# EAGLE design RAMPSDC (EAGLE 8.2.2)
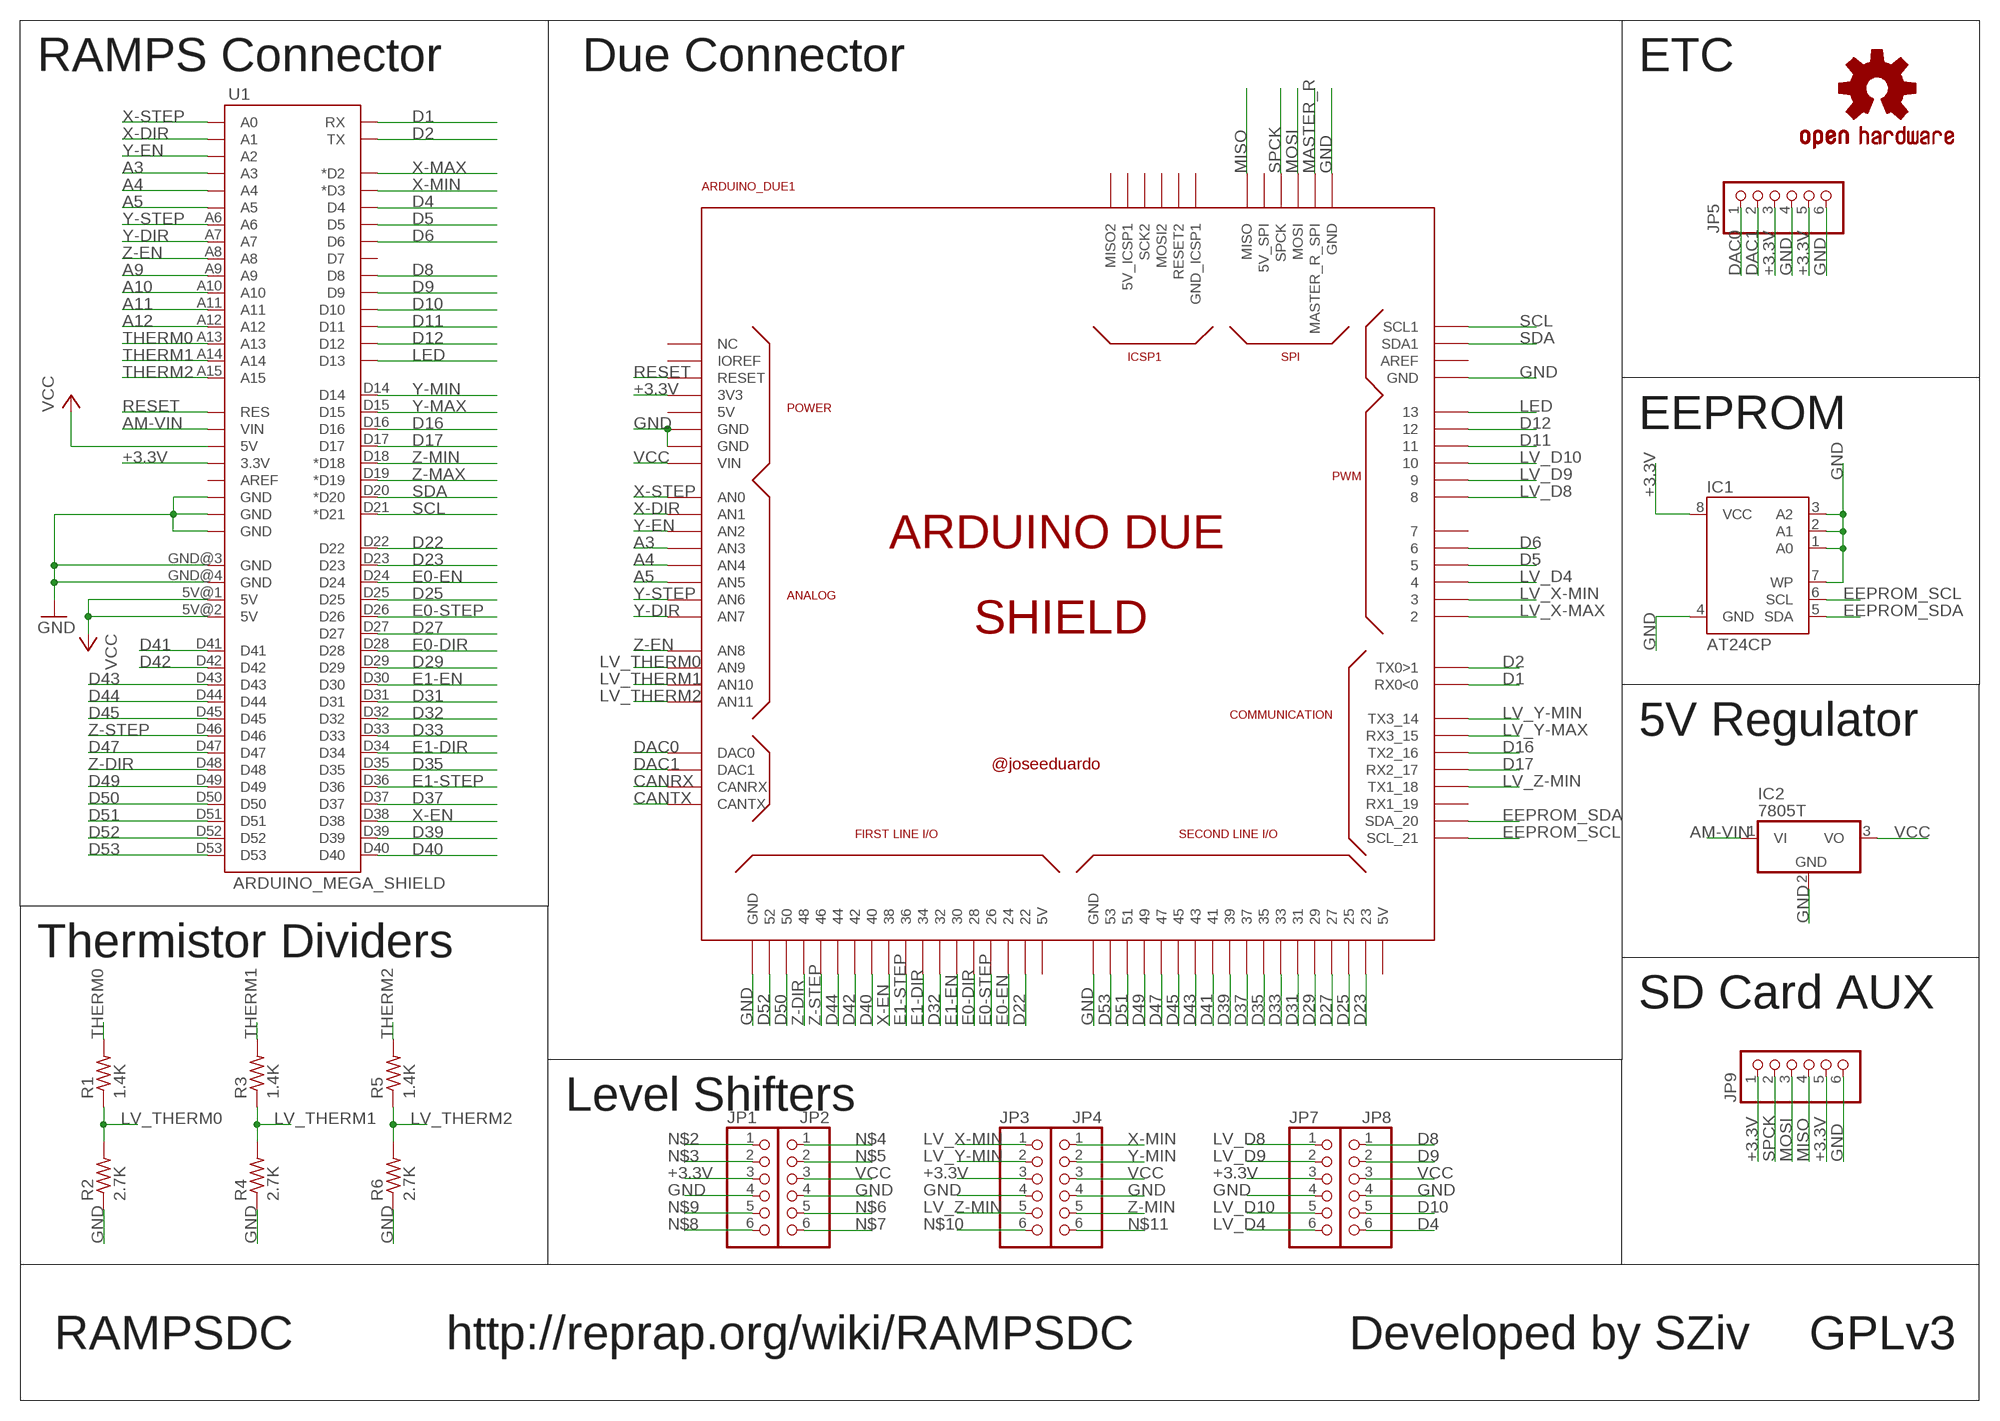
[diagram p0: schematic, sheet 1]

## Parts
ARDUINO_DUE1  ARDUINO_DUE_SHIELD  [ARDUINO_DUE_SHIELD]
IC1  AT24CP  [DIL08]
IC2  7805T  [TO220H]
JP1  PINHD-1X6  [1X06]
JP2  PINHD-1X6  [1X06]
JP3  PINHD-1X6  [1X06]
JP4  PINHD-1X6  [1X06]
JP5  PINHD-1X6  [1X06]
JP7  PINHD-1X6  [1X06]
JP8  PINHD-1X6  [1X06]
JP9  PINHD-1X6  [1X06]
LOGO1  OSHW-LOGOS  [OSHW-LOGO-S]
LOGO2  OSHW-LOGOL-COPPER  [OSHW-LOGO-L_COPPER]
R1  1.4K  R-US_R0805  [R0805]
R2  2.7K  R-US_R0805  [R0805]
R3  1.4K  R-US_R0805  [R0805]
R4  2.7K  R-US_R0805  [R0805]
R5  1.4K  R-US_R0805  [R0805]
R6  2.7K  R-US_R0805  [R0805]
U1  ARDUINO_MEGA_SHIELD  [ARDUINO_MEGA_SHIELD]

## Nets
+3.3V: ARDUINO_DUE1.3V3 IC1.8(VCC) JP1.3 JP3.3 JP5.3 JP5.5 JP7.3 JP9.1 JP9.5 U1.3.3V
A3: ARDUINO_DUE1.A3(AN3) U1.A3
A4: ARDUINO_DUE1.A4(AN4) U1.A4
A5: ARDUINO_DUE1.A5(AN5) U1.A5
A9: U1.A9
A10: U1.A10
A11: U1.A11
A12: U1.A12
AM-VIN: IC2.1(VI) U1.VIN
CANRX: ARDUINO_DUE1.CANRX
CANTX: ARDUINO_DUE1.CANTX
D1: ARDUINO_DUE1.0(RX0<0) U1.RX
D2: ARDUINO_DUE1.1(TX0>1) U1.TX
D4: JP8.6 U1.D4
D5: ARDUINO_DUE1.5 U1.D5
D6: ARDUINO_DUE1.6 U1.D6
D8: JP8.1 U1.D8
D9: JP8.2 U1.D9
D10: JP8.5 U1.D10
D11: ARDUINO_DUE1.11 U1.D11
D12: ARDUINO_DUE1.12 U1.D12
D16: ARDUINO_DUE1.16(TX2_16) U1.D16
D17: ARDUINO_DUE1.17(RX2_17) U1.D17
D22: ARDUINO_DUE1.22 U1.D22
D23: ARDUINO_DUE1.23 U1.D23
D25: ARDUINO_DUE1.25 U1.D25
D27: ARDUINO_DUE1.27 U1.D27
D29: ARDUINO_DUE1.29 U1.D29
D31: ARDUINO_DUE1.31 U1.D31
D32: ARDUINO_DUE1.32 U1.D32
D33: ARDUINO_DUE1.33 U1.D33
D35: ARDUINO_DUE1.35 U1.D35
D37: ARDUINO_DUE1.37 U1.D37
D39: ARDUINO_DUE1.39 U1.D39
D40: ARDUINO_DUE1.40 U1.D40
D41: ARDUINO_DUE1.41 U1.D41
D42: ARDUINO_DUE1.42 U1.D42
D43: ARDUINO_DUE1.43 U1.D43
D44: ARDUINO_DUE1.44 U1.D44
D45: ARDUINO_DUE1.45 U1.D45
D47: ARDUINO_DUE1.47 U1.D47
D49: ARDUINO_DUE1.49 U1.D49
D50: ARDUINO_DUE1.50 U1.D50
D51: ARDUINO_DUE1.51 U1.D51
D52: ARDUINO_DUE1.52 U1.D52
D53: ARDUINO_DUE1.53 U1.D53
DAC0: ARDUINO_DUE1.DAC0 JP5.1
DAC1: ARDUINO_DUE1.DAC1 JP5.2
E0-DIR: ARDUINO_DUE1.28 U1.D28
E0-EN: ARDUINO_DUE1.24 U1.D24
E0-STEP: ARDUINO_DUE1.26 U1.D26
E1-DIR: ARDUINO_DUE1.34 U1.D34
E1-EN: ARDUINO_DUE1.30 U1.D30
E1-STEP: ARDUINO_DUE1.36 U1.D36
EEPROM_SCL: ARDUINO_DUE1.21(SCL_21) IC1.6(SCL)
EEPROM_SDA: ARDUINO_DUE1.20(SDA_20) IC1.5(SDA)
GND: ARDUINO_DUE1.GND ARDUINO_DUE1.GND_1(GND) ARDUINO_DUE1.GND_2(GND) ARDUINO_DUE1.GND_3(GND) ARDUINO_DUE1.GND_4(GND) ARDUINO_DUE1.GND_5(GND) IC1.1(A0) IC1.2(A1) IC1.3(A2) IC1.4(GND) IC1.7(WP) IC2.2(GND) JP1.4 JP2.4 JP3.4 JP4.4 JP5.4 JP5.6 JP7.4 JP8.4 JP9.6 R2.1 R4.1 R6.1 U1.GND@0(GND) U1.GND@1(GND) U1.GND@2(GND) U1.GND@3(GND) U1.GND@4(GND)
LED: ARDUINO_DUE1.13 U1.D13
LV_D4: ARDUINO_DUE1.4 JP7.6
LV_D8: ARDUINO_DUE1.8 JP7.1
LV_D9: ARDUINO_DUE1.9 JP7.2
LV_D10: ARDUINO_DUE1.10 JP7.5
LV_THERM0: ARDUINO_DUE1.A9(AN9) R1.1 R2.2
LV_THERM1: ARDUINO_DUE1.A10(AN10) R3.1 R4.2
LV_THERM2: ARDUINO_DUE1.A11(AN11) R5.1 R6.2
LV_X-MAX: ARDUINO_DUE1.2
LV_X-MIN: ARDUINO_DUE1.3 JP3.1
LV_Y-MAX: ARDUINO_DUE1.15(RX3_15)
LV_Y-MIN: ARDUINO_DUE1.14(TX3_14) JP3.2
LV_Z-MIN: ARDUINO_DUE1.18(TX1_18) JP3.5
MASTER_R: ARDUINO_DUE1.MASTER_RESET_SPI(MASTER_R_SPI)
MISO: ARDUINO_DUE1.MISO JP9.4
MOSI: ARDUINO_DUE1.MOSI JP9.3
N$2: JP1.1
N$3: JP1.2
N$4: JP2.1
N$5: JP2.2
N$6: JP2.5
N$7: JP2.6
N$8: JP1.6
N$9: JP1.5
N$10: JP3.6
N$11: JP4.6
RESET: ARDUINO_DUE1.RESET U1.RES
SCL: ARDUINO_DUE1.SCL1 U1.D21(*D21)
SDA: ARDUINO_DUE1.SDA1 U1.D20(*D20)
SPCK: ARDUINO_DUE1.SPCK JP9.2
THERM0: R1.2 U1.A13
THERM1: R3.2 U1.A14
THERM2: R5.2 U1.A15
VCC: ARDUINO_DUE1.VIN IC2.3(VO) JP2.3 JP4.3 JP8.3 U1.5V@0(5V) U1.5V@1(5V) U1.5V@2(5V)
X-DIR: ARDUINO_DUE1.A1(AN1) U1.A1
X-EN: ARDUINO_DUE1.38 U1.D38
X-MAX: U1.D2(*D2)
X-MIN: JP4.1 U1.D3(*D3)
X-STEP: ARDUINO_DUE1.A0(AN0) U1.A0
Y-DIR: ARDUINO_DUE1.A7(AN7) U1.A7
Y-EN: ARDUINO_DUE1.A2(AN2) U1.A2
Y-MAX: U1.D15
Y-MIN: JP4.2 U1.D14
Y-STEP: ARDUINO_DUE1.A6(AN6) U1.A6
Z-DIR: ARDUINO_DUE1.48 U1.D48
Z-EN: ARDUINO_DUE1.A8(AN8) U1.A8
Z-MAX: U1.D19(*D19)
Z-MIN: JP4.5 U1.D18(*D18)
Z-STEP: ARDUINO_DUE1.46 U1.D46
Unconnected: ARDUINO_DUE1.5V0(5V) ARDUINO_DUE1.5V0_1(5V) ARDUINO_DUE1.5V0_2(5V) ARDUINO_DUE1.5V_2(5V_SPI) ARDUINO_DUE1.5V_ICSP1 ARDUINO_DUE1.7 ARDUINO_DUE1.19(RX1_19) ARDUINO_DUE1.AREF ARDUINO_DUE1.GND_ICSP1 ARDUINO_DUE1.IOREF ARDUINO_DUE1.MISO2 ARDUINO_DUE1.MOSI2 ARDUINO_DUE1.NC_2(NC) ARDUINO_DUE1.RESET2 ARDUINO_DUE1.SCK2 U1.AREF U1.D7

## Notes on the sheet
- RAMPS Connector | Due Connector | ETC
- EEPROM
- 5V Regulator
- Thermistor Dividers
- SD Card AUX
- Level Shifters
- RAMPSDC | http://reprap.org/wiki/RAMPSDC | Developed by SZiv | GPLv3

## Library data of the parts
ARDUINO_DUE1 = arduino_due_shield:ARDUINO_DUE_SHIELD
IC1 = atmel:AT24C*: 2-wire serial EEPROM; MPN: AT24C1024BW-SH-B; OC_FARNELL: 1362646; OC_NEWARK: 03P2044
IC2 = adafruit:78*: Positive VOLTAGE REGULATOR Added bigger pads to the TO-92 package
JP1-JP5 JP7-JP9 = adafruit:PINHD-1X6: PIN HEADER
LOGO1 LOGO2 = SparkFun-Aesthetics:OSHW-LOGO: Open-Source Hardware (OSHW) Logo This logo indicates the piece of hardware it is found on incorporates a OSHW license and/or adheres to the definition of open source hardware found here: http://freedomdefined.org/OSHW
R1-R6 = adafruit:R-US_: RESISTOR, American symbol
U1 = RAMPS:ARDUINO_MEGA_SHIELD

## Board
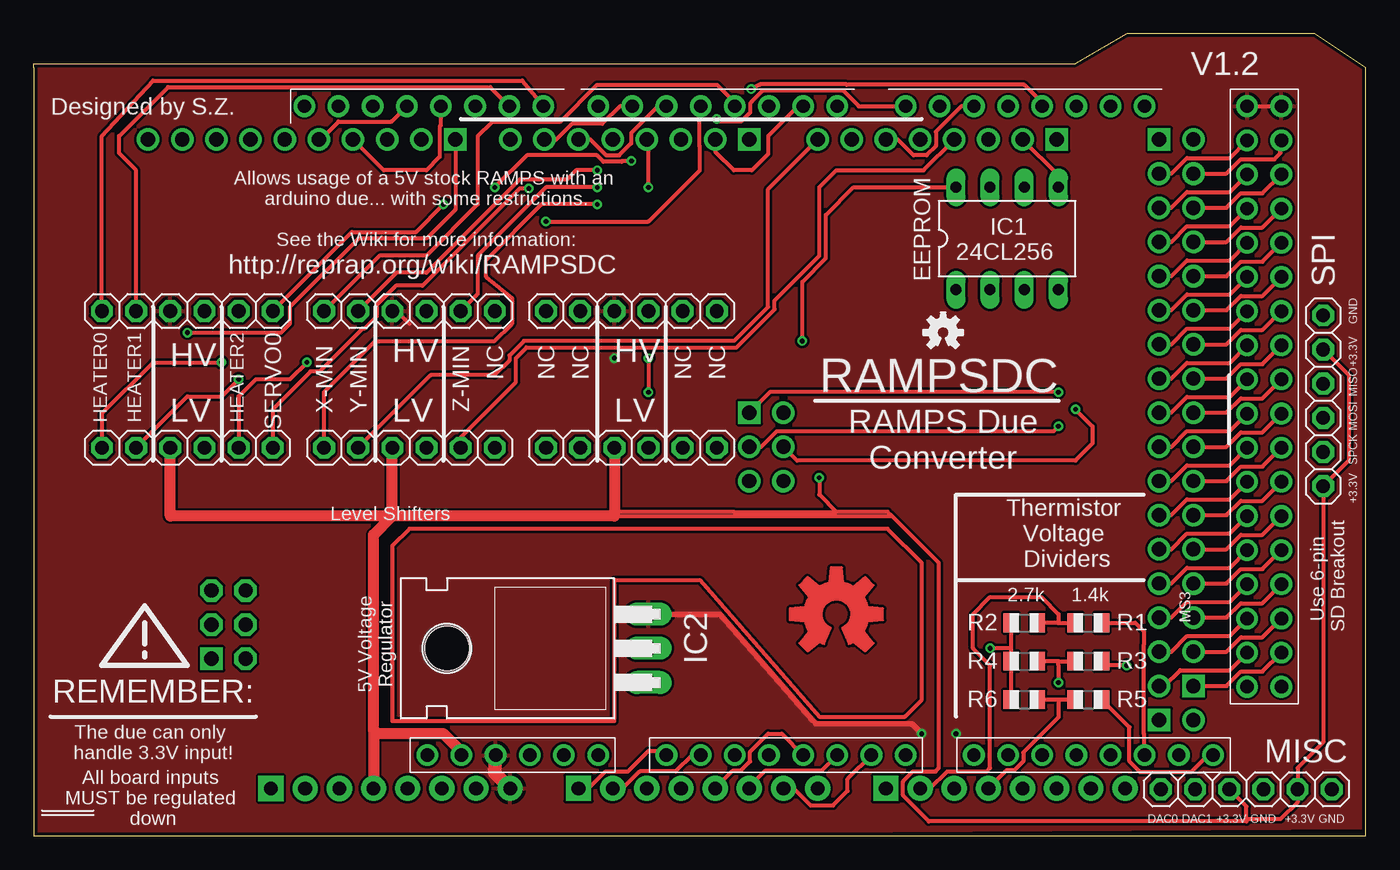
[diagram p1: board, top side]
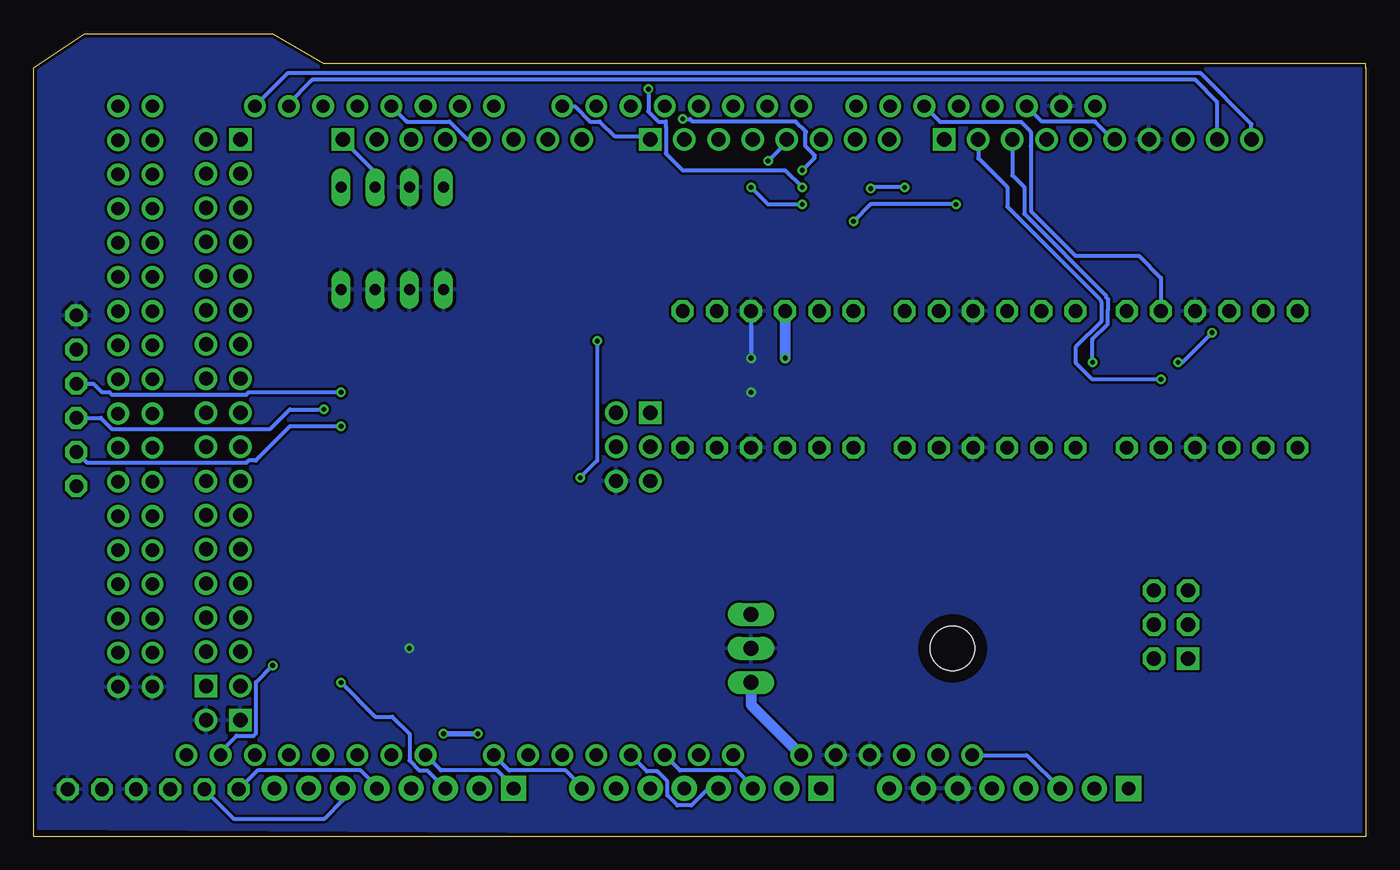
[diagram p2: board, bottom side, seen from below]

Size 99.06 x 59.69 mm. Coordinates in mm from the lower left corner, seen from the top.
Outline: 99.05,57.14 99.05,0 0,0 0,57.14
Outline: 99.06,57.15 95.25,59.69 81.28,59.69 77.47,57.47 0,57.47 0,57.15
Copper layers (1*16): Top 0.035mm / dielectric 1.5mm / Bottom 0.035mm
Design rules "GoldPhoenix": minimum track width 7mil, minimum drill 15mil, track to track 7mil, track to pad 7mil, pad to pad 7mil, via to via 7mil, smd to smd 7mil, copper to edge 10mil, drill to drill 8mil, minimum pad ring 12mil, minimum via ring 7mil, stop-mask expansion 4mil, vias tented up to drill 25mil, thermal gap 10mil

### Footprints (pad centres in the part's own frame; a part is rotated, then mirrored left to right if it is on the bottom)
ARDUINO_DUE_SHIELD = drill 1.067 square: 0 63.373,51.816; 5V0_1 93.853,51.816; 8 41.529,51.816; 21 86.233,51.816; 53 96.393,11.176; GND_2 93.853,8.636; MISO 63.373,31.496; MISO2 23.384,13.196 | drill 1.067: 1 60.833,51.816; 2 58.293,51.816; 3 55.753,51.816; 4 53.213,51.816; 5 50.673,51.816; 5V0_2 96.393,51.816; 5V_2 65.913,31.496; 6 48.133,51.816; 7 45.593,51.816; 9 38.989,51.816; 10 36.449,51.816; 11 33.909,51.816; 12 31.369,51.816; 13 28.829,51.816; 14 68.453,51.816; 15 70.993,51.816; 16 73.533,51.816; 17 76.073,51.816; 18 78.613,51.816; 19 81.153,51.816; 20 83.693,51.816; 22 93.853,49.276; 23 96.393,49.276; 24 93.853,46.736; 25 96.393,46.736; 26 93.853,44.196; 27 96.393,44.196; 28 93.853,41.656; 29 96.393,41.656; 30 93.853,39.116; 31 96.393,39.116; 32 93.853,36.576; 33 96.393,36.576; 34 93.853,34.036; 35 96.393,34.036; 36 93.853,31.496; 37 96.393,31.496; 38 93.853,28.956; 39 96.393,28.956; 40 93.853,26.416; 41 96.393,26.416; 42 93.853,23.876; 43 96.393,23.876; 44 93.853,21.336; 45 96.393,21.336; 46 93.853,18.796; 47 96.393,18.796; 48 93.853,16.256; 49 96.393,16.256; 50 93.853,13.716; 51 96.393,13.716; 52 93.853,11.176; AREF 23.749,51.816; GND_3 96.393,8.636; GND_4 26.289,51.816; GND_5 65.913,26.416; MASTER_RESET_SPI 63.373,26.416; MOSI 65.913,28.956; SCL1 18.669,51.816; SDA1 21.209,51.816; SPCK 63.373,28.956 | drill 1.016 pad 1.88: 3V3 35.433,3.556; 5V0 37.973,3.556; A1 53.213,3.556; A2 55.753,3.556; A3 58.293,3.556; A4 60.833,3.556; A5 63.373,3.556; A6 65.913,3.556; A7 68.453,3.556; A9 76.073,3.556; A10 78.613,3.556; A11 81.153,3.556; CANRX 88.773,3.556; CANTX 91.313,3.556; DAC0 83.693,3.556; DAC1 86.233,3.556; GND 40.513,3.556; GND_1 43.053,3.556; IOREF 30.346,3.543; RESET 32.893,3.555; VIN 45.593,3.556 | drill 1.067 octagon: 5V_ICSP1 25.924,13.196; GND_ICSP1 25.924,18.276; MOSI2 25.924,15.736; RESET2 23.384,18.276; SCK2 23.384,15.736 | drill 1.016 pad 1.88 square: A0 50.673,3.556; A8 73.533,3.556; NC_2 27.806,3.543
DIL08 = drill 0.813 long: 1 -3.81,-3.81; 2 -1.27,-3.81; 3 1.27,-3.81; 4 3.81,-3.81; 5 3.81,3.81; 6 1.27,3.81; 7 -1.27,3.81; 8 -3.81,3.81
TO220H = drill 1.118 long: 1 -2.54,-10.16; 2 0,-10.16; 3 2.54,-10.16 | hole 3.302: 0,4.826
1X06 = drill 1.016 octagon: 1 -6.35,0; 2 -3.81,0; 3 -1.27,0; 4 1.27,0; 5 3.81,0; 6 6.35,0
R0805 = smd 1.1 x 1.4: 1 -1,0; 2 1,0
ARDUINO_MEGA_SHIELD = drill 1 pad 1.422: 3.3V 50.8,26.67; 5V@0 50.8,29.21; 5V@1 2.54,85.09; 5V@2 2.54,87.63; A0 50.8,41.91; A1 50.8,44.45; A2 50.8,46.99; A3 50.8,49.53; A4 50.8,52.07; A5 50.8,54.61; A6 50.8,57.15; A7 50.8,59.69; A8 50.8,64.77; A9 50.8,67.31; A10 50.8,69.85; A11 50.8,72.39; A12 50.8,74.93; A13 50.8,77.47; A14 50.8,80.01; A15 50.8,82.55; AREF 2.54,14.986; D2 2.54,49.53; D3 2.54,46.99; D4 2.54,44.45; D5 2.54,41.91; D6 2.54,39.37; D7 2.54,36.83; D8 2.54,32.766; D9 2.54,30.226; D10 2.54,27.686; D11 2.54,25.146; D12 2.54,22.606; D13 2.54,20.066; D14 2.54,59.69; D15 2.54,62.23; D16 2.54,64.77; D17 2.54,67.31; D18 2.54,69.85; D19 2.54,72.39; D20 2.54,74.93; D21 2.54,77.47; D22 5.08,85.09; D23 5.08,87.63; D24 7.62,85.09; D25 7.62,87.63; D26 10.16,85.09; D27 10.16,87.63; D28 12.7,85.09; D29 12.7,87.63; D30 15.24,85.09; D31 15.24,87.63; D32 17.78,85.09; D33 17.78,87.63; D34 20.32,85.09; D35 20.32,87.63; D36 22.86,85.09; D37 22.86,87.63; D38 25.4,85.09; D39 25.4,87.63; D40 27.94,85.09; D41 27.94,87.63; D42 30.48,85.09; D43 30.48,87.63; D44 33.02,85.09; D45 33.02,87.63; D46 35.56,85.09; D47 35.56,87.63; D48 38.1,85.09; D49 38.1,87.63; D50 40.64,85.09; D51 40.64,87.63; D52 43.18,85.09; D53 43.18,87.63; GND@0 50.8,31.75; GND@1 50.8,34.29; GND@2 2.54,17.526; GND@3 45.72,85.09; GND@4 45.72,87.63; RES 50.8,24.13; RX 2.54,54.61; TX 2.54,52.07; VIN 50.8,36.83

### Placement (x,y rotation side)
ARDUINO_DUE1  -10.16,0 0 top
IC1  72.39,44.45 0 top
IC2  35.56,13.97 90 top
JP1  44.45,28.89 0 top
JP2  44.45,39.05 0 top
JP3  27.94,28.89 0 top
JP4  27.94,39.05 0 top
JP5  90.17,3.49 0 top
JP7  11.43,28.89 0 top
JP8  11.43,39.05 0 top
JP9  95.89,32.38 90 top
LOGO1  67.63,37.47 0 top
LOGO2  59.69,16.51 0 top
R1  78.42,15.88 0 top
R2  73.66,15.88 0 top
R3  78.42,13.02 0 top
R4  73.66,13.02 0 top
R5  78.42,10.16 0 top
R6  73.66,10.16 0 top
U1  5.14,56.83 270 top

### Tracks (layer width: path | path; a pad name or v marks a point on that pad's centre or on a via)
+3.3V  (via drill 0.35)
  Top 0.305: 90.17,1.1 66.57,1.1 64.64,3.03 64.64,4.08 65.39,4.83 67.06,4.83 67.31,5.08 67.31,20.32 63.82,23.81 | 63.82,23.81 63.5,24.13 59.69,24.13 | 52.04,24.13 59.69,24.13 | 52.04,24.13 43.5,24.13 43.18,23.81 63.82,23.81 | 52.05,24.13 52.04,24.13 | 59.69,24.13 58.42,25.4 v58.42,26.67 | v57.15,36.83 57.15,41.23 58.9,42.98 58.9,46.2 60.96,48.26 IC1.8 | 90.17,1.1 90.17,2.22 JP5.3 | 90.17,1.1 90.33,1.27 92.71,1.27 93.98,2.54 93.98,3.23 JP5.5 93.98,5.08 95.89,6.99 JP9.1 97.79,27.94 97.79,34.29 JP9.5
  Top 0.813: 26.67,23.81 JP3.3 | 26.67,23.81 10.16,23.81 JP7.3 | JP1.3 43.18,23.81 26.67,23.81 | 25.27,7.9 ARDUINO_DUE1.3V3 | 25.27,7.9 25.27,22.42 26.67,23.81 | U1.3.3V 31.81,6.29 30.48,7.62 25.4,7.62 25.4,7.77 25.27,7.9
  Bottom 0.305: v57.15,36.83 57.15,27.94 v58.42,26.67
A3
  Bottom 0.305: U1.A3 53.47,4.83 52.69,4.83 51.94,4.08 51.94,3.03 51.2,2.29 50.15,2.29 48.88,3.56 ARDUINO_DUE1.A3
A4
  Top 0.305: ARDUINO_DUE1.A4 52.01,4.9 52.6,4.9 53.27,5.56 53.27,6.28 54.61,7.62 55.63,7.62 U1.A4
A5
  Top 0.305: ARDUINO_DUE1.A5 53.21,3.68 54.43,4.9 58.62,4.9 U1.A5
AM-VIN
  Bottom 0.813: IC2.1 45.72,9.78 U1.VIN
D1
  Bottom 0.305: U1.RX 58.82,54.29 57.68,53.16 56.97,53.16 55.88,52.07 53.47,52.07 ARDUINO_DUE1.0
D2
  Top 0.305: ARDUINO_DUE1.1 50.67,50.93 52.07,49.53 53.4,49.53 54.61,50.74 54.61,52.07 56.83,54.29 U1.TX
D4  (via drill 0.35)
  Top 0.305: U1.D4 49.51,54.2 49.51,51.33 49.53,51.31 49.53,49.53 45.72,45.72 v38.1,45.72 | v30.48,46.99 28.42,44.93 23.66,44.93 JP8.6
  Bottom 0.305: v30.48,46.99 36.83,46.99 v38.1,45.72
D5
  Top 0.305: ARDUINO_DUE1.5 41.4,51.82 42.57,50.65 43.54,50.65 44.42,51.53 44.42,52.3 46.42,54.29 U1.D5
D6
  Top 0.305: ARDUINO_DUE1.6 38.86,51.82 40.03,52.98 42.28,52.98 43.59,54.29 U1.D6
D8
  Top 0.305: JP8.1 5.08,52.07 8.89,56.2 36.32,56.2 U1.D8
D9
  Top 0.305: JP8.2 7.62,49.53 6.35,50.8 6.35,52.07 9.99,55.72 33.95,55.72 U1.D9
D10
  Bottom 0.305: U1.D10 31.65,53.11 25.63,53.11 24.92,52.4 24.92,51.33 24.89,51.31 24.89,46.48 21.59,43.18 16.89,43.18 15.24,41.52 JP8.5
D11
  Top 0.305: U1.D11 30.29,52.88 30.2,52.79 30.2,50.52 29.21,49.53 26.04,49.53 ARDUINO_DUE1.11
D12
  Top 0.305: ARDUINO_DUE1.12 21.34,51.82 22.68,53.16 26.61,53.16 U1.D12
D16
  Top 0.305: U1.D16 68.98,54.29 67.08,52.4 67.08,51.33 66.4,50.65 65.43,50.65 64.26,51.82 ARDUINO_DUE1.16
D17
  Bottom 0.305: ARDUINO_DUE1.17 66.8,51.82 68.14,53.16 71.32,53.16 U1.D17
D22
  Top 0.305: ARDUINO_DUE1.22 84.58,49.28 85.75,50.44 88.92,50.44 U1.D22
D23
  Top 0.305: ARDUINO_DUE1.23 88.69,49.28 89.76,50.35 92.26,50.35 92.71,50.8 92.71,51.69 U1.D23
D25
  Top 0.305: ARDUINO_DUE1.25 88.69,46.74 89.76,47.81 91.37,47.81 U1.D25
D27
  Top 0.305: ARDUINO_DUE1.27 88.69,44.2 89.76,45.27 91.37,45.27 U1.D27
D29
  Top 0.305: ARDUINO_DUE1.29 88.69,41.66 89.76,42.73 91.37,42.73 U1.D29
D31
  Top 0.305: ARDUINO_DUE1.31 88.69,39.12 89.76,40.19 91.37,40.19 U1.D31
D32
  Top 0.305: ARDUINO_DUE1.32 84.58,36.58 85.75,37.74 88.92,37.74 U1.D32
D33
  Top 0.305: ARDUINO_DUE1.33 88.69,36.58 89.76,37.65 91.37,37.65 U1.D33
D35
  Top 0.305: ARDUINO_DUE1.35 88.69,34.04 89.76,35.11 91.37,35.11 U1.D35
D37
  Top 0.305: ARDUINO_DUE1.37 88.69,31.5 89.76,32.57 91.37,32.57 U1.D37
D39
  Top 0.305: ARDUINO_DUE1.39 88.69,28.96 89.76,30.03 91.37,30.03 U1.D39
D40
  Top 0.305: ARDUINO_DUE1.40 84.58,26.42 85.75,27.58 88.92,27.58 U1.D40
D41
  Top 0.305: ARDUINO_DUE1.41 88.69,26.42 89.76,27.49 91.37,27.49 U1.D41
D42
  Top 0.305: ARDUINO_DUE1.42 84.58,23.88 85.75,25.04 88.92,25.04 U1.D42
D43
  Top 0.305: ARDUINO_DUE1.43 88.69,23.88 89.76,24.95 91.37,24.95 U1.D43
D44
  Top 0.305: ARDUINO_DUE1.44 84.58,21.34 85.75,22.5 88.92,22.5 U1.D44
D45
  Top 0.305: ARDUINO_DUE1.45 88.69,21.34 89.76,22.41 91.37,22.41 U1.D45
D47
  Top 0.305: ARDUINO_DUE1.47 88.69,18.8 89.76,19.87 91.37,19.87 U1.D47
D49
  Top 0.305: ARDUINO_DUE1.49 88.69,16.26 89.76,17.33 91.37,17.33 U1.D49
D50
  Top 0.305: ARDUINO_DUE1.50 84.58,13.72 85.75,14.88 88.92,14.88 U1.D50
D51
  Top 0.305: ARDUINO_DUE1.51 88.69,13.72 89.76,14.79 91.37,14.79 U1.D51
D52
  Top 0.305: ARDUINO_DUE1.52 84.09,11.18 85.26,12.34 88.92,12.34 U1.D52
D53
  Top 0.305: ARDUINO_DUE1.53 88.69,11.18 89.76,12.25 91.37,12.25 U1.D53
DAC0
  Bottom 0.305: ARDUINO_DUE1.DAC0 73.53,3.68 74.75,4.9 82.42,4.9 JP5.1
DAC1
  Bottom 0.305: ARDUINO_DUE1.DAC1 76.07,2.67 77.47,1.27 84.14,1.27 JP5.2
E0-DIR
  Top 0.305: ARDUINO_DUE1.28 84.58,41.66 85.75,42.82 88.92,42.82 U1.D28
E0-EN
  Top 0.305: ARDUINO_DUE1.24 84.58,46.74 85.75,47.9 88.92,47.9 U1.D24
E0-STEP
  Top 0.305: ARDUINO_DUE1.26 84.58,44.2 85.75,45.36 88.92,45.36 U1.D26
E1-DIR
  Top 0.305: ARDUINO_DUE1.34 84.58,34.04 85.75,35.2 88.92,35.2 U1.D34
E1-EN
  Top 0.305: ARDUINO_DUE1.30 84.58,39.12 85.75,40.28 88.92,40.28 U1.D30
E1-STEP
  Top 0.305: ARDUINO_DUE1.36 84.58,31.5 85.75,32.66 88.92,32.66 U1.D36
EEPROM_SCL
  Bottom 0.305: IC1.6 73.66,49.4 ARDUINO_DUE1.21
EEPROM_SDA
  Top 0.305: IC1.5 76.2,49.15 ARDUINO_DUE1.20
GND  (via drill 0.35)
  Top 0.305: R6.1 R4.1 72.66,13.97 | R2.1 72.66,13.97 | 72.66,13.97 v71.12,13.97 | v45.72,35.56 v45.72,33.02
  Bottom 0.305: JP2.4 v45.72,35.56
  pour Bottom: -1.27,57.15 99.38,60.33 99.38,0.64 -1.27,0
HS
  Top 0.305: 26.67,21.59 26.67,8.57 43.18,8.57 43.18,19.05 49.53,19.05 58.42,8.89 64.77,8.89 66.04,10.16 66.04,20.32 63.5,22.86 27.94,22.86 26.67,21.59
LED
  Bottom 0.305: ARDUINO_DUE1.13 18.8,51.82 20.14,53.16 24.07,53.16 U1.D13
LV_D4  (via drill 0.35)
  Top 0.305: v44.45,50.21 43.78,50.21 43.74,50.16 42.37,50.16 41.89,50.65 36.68,50.65 v34.29,48.26 | v36.83,48.16 36.15,48.16 28.92,40.93 26.93,40.93 25.53,39.53 25.53,38.67 24.63,37.77 24.46,37.77 21.25,34.56 20.59,34.56 17.78,31.75 JP7.6
  Bottom 0.305: ARDUINO_DUE1.4 43.05,51.61 v44.45,50.21 | v34.29,48.26 36.73,48.26 v36.83,48.16
LV_D8  (via drill 0.35)
  Top 0.305: JP7.1 5.08,31.43 8.89,35.24 v13.97,35.24 | v11.43,37.45 18.4,37.45 19.05,38.1 19.05,39.34 24.16,44.45 29.21,44.45 31.37,46.61 ARDUINO_DUE1.8
  Bottom 0.305: v13.97,35.24 13.64,35.24 v11.43,37.45
LV_D9  (via drill 0.35)
  Top 0.305: JP7.2 11.43,32.7 13.97,32.7 v15.24,33.97
  Bottom 0.305: v15.24,33.97 20.32,33.97 21.59,35.24 21.59,36.37 19.68,38.28 19.68,39.77 19.81,39.97 26.67,46.84 26.67,48.26 28.83,50.42 ARDUINO_DUE1.9
LV_D10  (via drill 0.35)
  Top 0.305: v20.32,35.24 19.05,33.97 16.51,33.97 15.24,32.7 JP7.5
  Bottom 0.305: ARDUINO_DUE1.10 26.29,49.15 25.4,48.26 25.4,46.29 19.4,40.3 19.32,40.17 19.32,40.11 19.3,40.07 19.2,39.97 19.17,39.92 19.17,39.16 19.2,39.12 19.2,38.08 20.32,36.96 v20.32,35.24
LV_THERM0
  Top 0.305: 76.11,15.88 R1.1 | 76.11,15.88 R2.2 | ARDUINO_DUE1.A9 66.66,3.56 67.93,4.83 70.87,4.83 71.12,5.08 71.12,12.7 69.85,13.97 69.85,16.51 71.12,17.78 74.93,17.78 76.2,16.51 76.2,15.97 76.11,15.88
LV_THERM1  (via drill 0.35)
  Top 0.305: 76.2,13.02 76.2,12.95 | v76.2,11.43 76.2,12.7 76.2,12.95 | 76.14,13.02 R3.1 | 76.14,13.02 R4.2 | 76.2,12.95 76.14,13.02
  Bottom 0.305: v76.2,11.43 73.66,8.89 72.39,8.89 71.12,7.62 71.12,5.63 70.38,4.9 69.79,4.9 ARDUINO_DUE1.A10
LV_THERM2
  Top 0.305: R5.1 76.2,10.16 | 76.2,10.16 R6.2 | ARDUINO_DUE1.A11 72.33,4.9 72.92,4.9 73.59,5.56 73.59,6.23 76.2,8.84 76.2,10.16
LV_X-MIN  (via drill 0.35)
  Top 0.305: JP3.1 21.59,33.02 25.4,36.83 34.29,36.83 35.56,38.1 35.56,40.01 33.66,41.59 33.66,42.86 37.78,46.99 v41.91,46.99 | v45.72,48.26 45.72,51.69 ARDUINO_DUE1.3
  Bottom 0.305: v41.91,46.99 44.45,46.99 v45.72,48.26
LV_Y-MIN
  Top 0.305: ARDUINO_DUE1.14 54.61,48.13 54.61,39.37 52.07,36.83 36.45,36.83 35.38,35.76 35.38,35.38 34.29,34.29 29.53,34.29 JP3.2
LV_Z-MIN
  Top 0.305: ARDUINO_DUE1.18 66.17,49.53 59.69,49.53 58.42,48.26 58.42,43.18 55.09,39.85 55.09,39.17 52.27,36.35 36.65,36.35 35.86,35.56 35.86,33.78 31.75,29.66 JP3.5
MISO  (via drill 0.35)
  Top 0.305: v76.2,33.02 54.74,33.02 ARDUINO_DUE1.MISO
  Bottom 0.305: JP9.4 94.61,33.66 93.98,33.02 93.43,33.02 93.24,32.84 83.24,32.84 83.06,33.02 v76.2,33.02
MOSI  (via drill 0.35)
  Top 0.305: v77.47,31.75 78.74,30.48 78.74,29.21 77.47,27.94 56.77,27.94 ARDUINO_DUE1.MOSI
  Bottom 0.305: JP9.3 94.06,31.11 93.24,30.3 81.46,30.3 80.01,31.75 v77.47,31.75
N$1
  pour Top: 26.67,8.89 26.67,21.59 27.94,22.86 63.5,22.86 66.04,20.32 66.04,8.89
RESET
  Bottom 0.305: U1.RES 25.21,6.03 ARDUINO_DUE1.RESET
SCL
  Bottom 0.305: ARDUINO_DUE1.SCL1 8.51,52.96 12.28,56.73 80.17,56.73 U1.D21
SDA
  Bottom 0.305: 80.17,54.42 80.33,54.61 | 80.17,54.42 U1.D20 | ARDUINO_DUE1.SDA1 11.05,54.6 12.7,56.25 78.34,56.25 80.17,54.42
SPCK  (via drill 0.35)
  Top 0.305: ARDUINO_DUE1.SPCK 54.1,28.96 55.27,30.12 75.84,30.12 v76.2,30.48
  Bottom 0.305: v76.2,30.48 80.01,30.48 82.55,27.94 83.06,27.94 83.24,27.76 95.07,27.76 JP9.2
THERM0
  Top 0.305: R1.2 81.92,15.88 82.55,15.24 82.55,14.22 82.53,14.2 82.53,7.66 82.55,7.64 82.55,6.1 U1.A13
THERM1  (via drill 0.35)
  Top 0.305: v81.28,12.7 79.74,12.7 R3.2
  Bottom 0.305: U1.A14 85.15,6.29 83.97,7.47 82.7,7.47 82.55,7.62 82.55,7.64 82.53,7.66 82.53,11.46 v81.28,12.7
THERM2
  Top 0.305: U1.A15 87.31,6.03 86.06,4.79 82.25,4.79 81.48,5.56 81.48,8.1 R5.2
VCC  (via drill 0.35)
  Top 0.305: U1.5V@1 U1.5V@2 | JP4.3 26.99,39.05 27.94,38.1
  Top 0.406: IC2.3 51.03,16.51 57.89,8.67 58.03,8.53 58.16,8.37 58.19,8.37 58.2,8.36 58.4,8.34 65.32,8.34 v66.04,7.62
  Top 1.016: U1.5V@0 34.29,4.7 ARDUINO_DUE1.VIN
  Bottom 0.406: v66.04,7.62 v68.58,7.62
  Bottom 0.813: JP2.3 v43.18,35.56
  pour Top: -1.27,57.15 99.38,60.33 99.38,0.64 -1.27,0
X-DIR
  Top 0.305: ARDUINO_DUE1.A1 43.8,3.56 45.07,4.83 47.74,4.83 48.95,6.03 U1.A1
X-EN
  Top 0.305: ARDUINO_DUE1.38 84.58,28.96 85.75,30.12 88.92,30.12 U1.D38
X-MIN
  Top 0.305: U1.D3 52.13,54.55 50.8,55.88 41.91,55.88 39.19,53.16 34.11,53.16 33.02,52.07 33.02,46.99 29.21,43.18 25.72,43.18 JP4.1
X-STEP
  Top 0.305: ARDUINO_DUE1.A0 41.26,3.56 42.53,4.83 44.2,4.83 45.72,6.35 46.74,6.35 U1.A0
Y-DIR
  Bottom 0.305: 64.77,6.35 U1.A7 63.7,4.9 59.51,4.9 58.29,3.68 ARDUINO_DUE1.A7
Y-EN
  Bottom 0.305: ARDUINO_DUE1.A2 45.59,3.68 46.81,4.9 51,4.9 U1.A2
Y-MIN  (via drill 0.35)
  Top 0.305: U1.D14 61.36,54.29 60.22,55.43 54.2,55.43 53.39,54.61 | 53.34,54.61 53.39,54.61 | 53.39,54.61 53.27,54.49 53.27,53.82 52.6,53.16 50.98,53.16 v50.8,53.34 | v41.91,49.53 40.34,49.53 39.65,48.85 36.15,48.85 29.21,41.91 26.99,41.91 JP4.2
  Bottom 0.305: v50.8,53.34 50.25,53.34 50.06,53.16 42.4,53.16 41.61,52.37 41.68,52.3 41.68,51.33 41,50.65 41,50.44 v41.91,49.53
Y-STEP
  Top 0.305: ARDUINO_DUE1.A6 56.5,3.56 57.77,2.29 59.44,2.29 60.52,3.37 60.52,4.25 U1.A6
  Bottom 0.305: U1.A6 62.23,6.35
Z-DIR
  Top 0.305: ARDUINO_DUE1.48 84.58,16.26 85.75,17.42 88.92,17.42 U1.D48
Z-EN
  Bottom 0.305: ARDUINO_DUE1.A8 63.37,3.68 64.59,4.9 68.78,4.9 U1.A8
Z-MIN  (via drill 0.35)
  Top 0.305: U1.D18 74.99,54.55 73.66,55.88 60.45,55.88 60.42,55.91 54,55.91 53.97,55.88 v53.34,55.56 | v41.91,48.26 38.1,48.26 33.02,43.18 33.02,40.32 JP4.5
  Bottom 0.305: v53.34,55.56 53.34,53.89 52.6,53.16 52.07,53.16 52.07,52.82 52.05,52.79 52.05,50.77 50.8,49.53 43.18,49.53 v41.91,48.26
Z-STEP
  Top 0.305: ARDUINO_DUE1.46 84.58,18.8 85.75,19.96 88.92,19.96 U1.D46

### Text on the board
tPlace: V1.2 | Designed by S.Z. | Allows usage of a 5V stock RAMPS with an / arduino due... with some restrictions. / / See the Wiki for more information: | http://reprap.org/wiki/RAMPSDC | 24CL256 | SPI | EEPROM | GND | HEATER0 | HEATER1 | HEATER2 | SERVO0 | X-MIN | Y-MIN | Z-MIN | NC | NC | NC | NC | NC | HV | HV | HV | +3.3V | RAMPSDC | MISO | LV | LV | LV | RAMPS Due / Converter | MOSI | SPCK | +3.3V | Thermistor / Voltage / Dividers | Use 6-pin / SD Breakout | 2.7k | 1.4k | 5V Voltage / Regulator | REMEMBER: | The due can only / handle 3.3V input! | MISC | All board inputs / MUST be regulated / down | DAC0 | DAC1 | +3.3V | GND | +3.3V | GND
tNames: MS3
_tsilk: Level Shifters